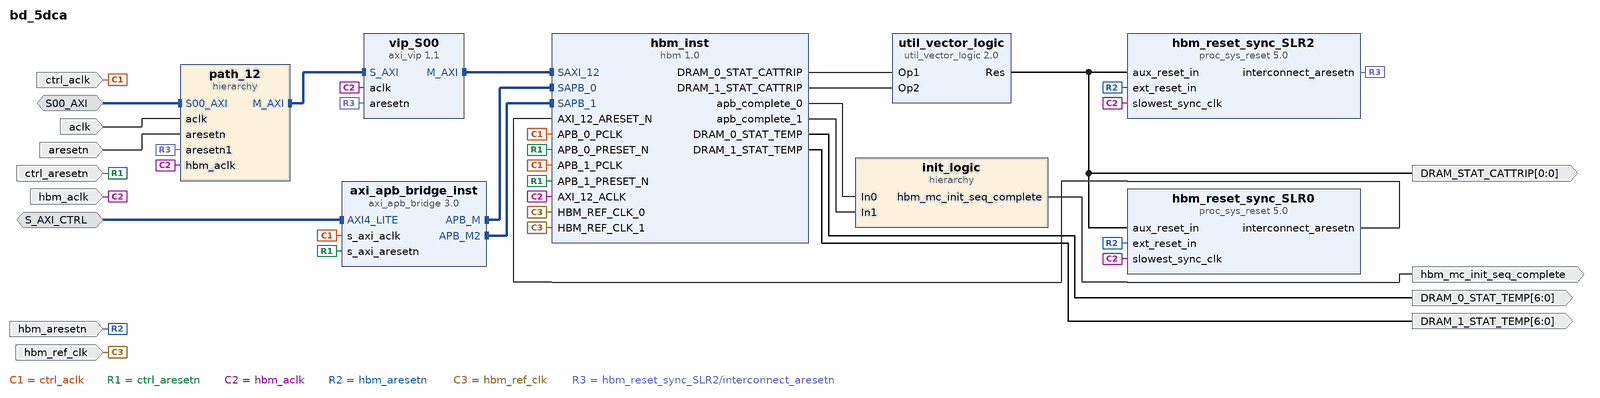
[diagram p0: block diagram of the top level]
# Vivado block design bd_5dca, xcu50-fsvh2104-2-e, Vivado 2022.1
create_bd_design bd_5dca

create_bd_intf_port -mode Slave -vlnv xilinx.com:interface:aximm_rtl:1.0 S_AXI_CTRL
set_property -dict {CONFIG.ADDR_WIDTH 23 CONFIG.PROTOCOL AXI4LITE} [get_bd_intf_ports S_AXI_CTRL]
create_bd_intf_port -mode Slave -vlnv xilinx.com:interface:aximm_rtl:1.0 S00_AXI
set_property -dict [list \
  CONFIG.ADDR_WIDTH 33 \
  CONFIG.DATA_WIDTH 512 \
  CONFIG.NUM_READ_OUTSTANDING 2 \
  CONFIG.NUM_WRITE_OUTSTANDING 2 \
  CONFIG.master_id 1 \
] [get_bd_intf_ports S00_AXI]
create_bd_port -dir I -type clk hbm_aclk
create_bd_port -dir I -type rst hbm_aresetn
set_property -dict {CONFIG.POLARITY ACTIVE_LOW} [get_bd_ports hbm_aresetn]
create_bd_port -dir I -type clk hbm_ref_clk
create_bd_port -dir O hbm_mc_init_seq_complete
create_bd_port -dir O -from 6 -to 0 DRAM_0_STAT_TEMP
create_bd_port -dir O -from 6 -to 0 DRAM_1_STAT_TEMP
create_bd_port -dir O -from 0 -to 0 -type intr DRAM_STAT_CATTRIP
create_bd_port -dir I -type clk ctrl_aclk
set_property -dict {CONFIG.ASSOCIATED_BUSIF S_AXI_CTRL CONFIG.ASSOCIATED_RESET ctrl_aresetn} [get_bd_ports ctrl_aclk]
create_bd_port -dir I -type rst ctrl_aresetn
set_property -dict {CONFIG.POLARITY ACTIVE_LOW} [get_bd_ports ctrl_aresetn]
create_bd_port -dir I -type clk aclk
set_property -dict {CONFIG.ASSOCIATED_BUSIF S00_AXI} [get_bd_ports aclk]
create_bd_port -dir I -type rst aresetn
set_property -dict {CONFIG.POLARITY ACTIVE_LOW} [get_bd_ports aresetn]

create_bd_cell -type ip -vlnv xilinx.com:ip:hbm:1.0 hbm_inst
set_property -dict [list \
  CONFIG.USER_CLK_SEL_LIST0 AXI_12_ACLK \
  CONFIG.USER_DIS_REF_CLK_BUFG TRUE \
  CONFIG.USER_HBM_DENSITY 8GB \
  CONFIG.USER_HBM_STACK 2 \
  CONFIG.USER_INIT_TIMEOUT_VAL 0 \
  CONFIG.USER_MC0_ECC_SCRUB_PERIOD 0x0032 \
  CONFIG.USER_MC0_ENABLE_ECC_CORRECTION true \
  CONFIG.USER_MC0_ENABLE_ECC_SCRUBBING true \
  CONFIG.USER_MC0_TEMP_CTRL_SELF_REF_INTVL true \
  CONFIG.USER_MC10_ECC_SCRUB_PERIOD 0x0032 \
  CONFIG.USER_MC10_ENABLE_ECC_CORRECTION true \
  CONFIG.USER_MC10_ENABLE_ECC_SCRUBBING true \
  CONFIG.USER_MC10_INITILIZE_MEM_USING_ECC_SCRUB true \
  CONFIG.USER_MC10_TEMP_CTRL_SELF_REF_INTVL true \
  CONFIG.USER_MC11_ECC_SCRUB_PERIOD 0x0032 \
  CONFIG.USER_MC11_ENABLE_ECC_CORRECTION true \
  CONFIG.USER_MC11_ENABLE_ECC_SCRUBBING true \
  CONFIG.USER_MC11_INITILIZE_MEM_USING_ECC_SCRUB true \
  CONFIG.USER_MC11_TEMP_CTRL_SELF_REF_INTVL true \
  CONFIG.USER_MC12_ECC_SCRUB_PERIOD 0x0032 \
  CONFIG.USER_MC12_ENABLE_ECC_CORRECTION true \
  CONFIG.USER_MC12_ENABLE_ECC_SCRUBBING true \
  CONFIG.USER_MC12_INITILIZE_MEM_USING_ECC_SCRUB true \
  CONFIG.USER_MC12_TEMP_CTRL_SELF_REF_INTVL true \
  CONFIG.USER_MC13_ECC_SCRUB_PERIOD 0x0032 \
  CONFIG.USER_MC13_ENABLE_ECC_CORRECTION true \
  CONFIG.USER_MC13_ENABLE_ECC_SCRUBBING true \
  CONFIG.USER_MC13_INITILIZE_MEM_USING_ECC_SCRUB true \
  CONFIG.USER_MC13_TEMP_CTRL_SELF_REF_INTVL true \
  CONFIG.USER_MC14_ECC_SCRUB_PERIOD 0x0032 \
  CONFIG.USER_MC14_ENABLE_ECC_CORRECTION true \
  CONFIG.USER_MC14_ENABLE_ECC_SCRUBBING true \
  CONFIG.USER_MC14_INITILIZE_MEM_USING_ECC_SCRUB true \
  CONFIG.USER_MC14_TEMP_CTRL_SELF_REF_INTVL true \
  CONFIG.USER_MC15_ECC_SCRUB_PERIOD 0x0032 \
  CONFIG.USER_MC15_ENABLE_ECC_CORRECTION true \
  CONFIG.USER_MC15_ENABLE_ECC_SCRUBBING true \
  CONFIG.USER_MC15_INITILIZE_MEM_USING_ECC_SCRUB true \
  CONFIG.USER_MC15_TEMP_CTRL_SELF_REF_INTVL true \
  CONFIG.USER_MC1_ECC_SCRUB_PERIOD 0x0032 \
  CONFIG.USER_MC1_ENABLE_ECC_CORRECTION true \
  CONFIG.USER_MC1_ENABLE_ECC_SCRUBBING true \
  CONFIG.USER_MC1_INITILIZE_MEM_USING_ECC_SCRUB true \
  CONFIG.USER_MC1_TEMP_CTRL_SELF_REF_INTVL true \
  CONFIG.USER_MC2_ECC_SCRUB_PERIOD 0x0032 \
  CONFIG.USER_MC2_ENABLE_ECC_CORRECTION true \
  CONFIG.USER_MC2_ENABLE_ECC_SCRUBBING true \
  CONFIG.USER_MC2_INITILIZE_MEM_USING_ECC_SCRUB true \
  CONFIG.USER_MC2_TEMP_CTRL_SELF_REF_INTVL true \
  CONFIG.USER_MC3_ECC_SCRUB_PERIOD 0x0032 \
  CONFIG.USER_MC3_ENABLE_ECC_CORRECTION true \
  CONFIG.USER_MC3_ENABLE_ECC_SCRUBBING true \
  CONFIG.USER_MC3_INITILIZE_MEM_USING_ECC_SCRUB true \
  CONFIG.USER_MC3_TEMP_CTRL_SELF_REF_INTVL true \
  CONFIG.USER_MC4_ECC_SCRUB_PERIOD 0x0032 \
  CONFIG.USER_MC4_ENABLE_ECC_CORRECTION true \
  CONFIG.USER_MC4_ENABLE_ECC_SCRUBBING true \
  CONFIG.USER_MC4_INITILIZE_MEM_USING_ECC_SCRUB true \
  CONFIG.USER_MC4_TEMP_CTRL_SELF_REF_INTVL true \
  CONFIG.USER_MC5_ECC_SCRUB_PERIOD 0x0032 \
  CONFIG.USER_MC5_ENABLE_ECC_CORRECTION true \
  CONFIG.USER_MC5_ENABLE_ECC_SCRUBBING true \
  CONFIG.USER_MC5_INITILIZE_MEM_USING_ECC_SCRUB true \
  CONFIG.USER_MC5_TEMP_CTRL_SELF_REF_INTVL true \
  CONFIG.USER_MC6_ECC_SCRUB_PERIOD 0x0032 \
  CONFIG.USER_MC6_ENABLE_ECC_CORRECTION true \
  CONFIG.USER_MC6_ENABLE_ECC_SCRUBBING true \
  CONFIG.USER_MC6_INITILIZE_MEM_USING_ECC_SCRUB true \
  CONFIG.USER_MC6_TEMP_CTRL_SELF_REF_INTVL true \
  CONFIG.USER_MC7_ECC_SCRUB_PERIOD 0x0032 \
  CONFIG.USER_MC7_ENABLE_ECC_CORRECTION true \
  CONFIG.USER_MC7_ENABLE_ECC_SCRUBBING true \
  CONFIG.USER_MC7_INITILIZE_MEM_USING_ECC_SCRUB true \
  CONFIG.USER_MC7_TEMP_CTRL_SELF_REF_INTVL true \
  CONFIG.USER_MC8_ECC_SCRUB_PERIOD 0x0032 \
  CONFIG.USER_MC8_ENABLE_ECC_CORRECTION true \
  CONFIG.USER_MC8_ENABLE_ECC_SCRUBBING true \
  CONFIG.USER_MC8_INITILIZE_MEM_USING_ECC_SCRUB true \
  CONFIG.USER_MC8_TEMP_CTRL_SELF_REF_INTVL true \
  CONFIG.USER_MC9_ECC_SCRUB_PERIOD 0x0032 \
  CONFIG.USER_MC9_ENABLE_ECC_CORRECTION true \
  CONFIG.USER_MC9_ENABLE_ECC_SCRUBBING true \
  CONFIG.USER_MC9_INITILIZE_MEM_USING_ECC_SCRUB true \
  CONFIG.USER_MC9_TEMP_CTRL_SELF_REF_INTVL true \
  CONFIG.USER_MC_ENABLE_00 TRUE \
  CONFIG.USER_MC_ENABLE_01 TRUE \
  CONFIG.USER_MC_ENABLE_02 TRUE \
  CONFIG.USER_MC_ENABLE_03 TRUE \
  CONFIG.USER_MC_ENABLE_04 TRUE \
  CONFIG.USER_MC_ENABLE_05 TRUE \
  CONFIG.USER_MC_ENABLE_06 TRUE \
  CONFIG.USER_MC_ENABLE_07 TRUE \
  CONFIG.USER_MC_ENABLE_08 TRUE \
  CONFIG.USER_MC_ENABLE_09 TRUE \
  CONFIG.USER_MC_ENABLE_10 TRUE \
  CONFIG.USER_MC_ENABLE_11 TRUE \
  CONFIG.USER_MC_ENABLE_12 TRUE \
  CONFIG.USER_MC_ENABLE_13 TRUE \
  CONFIG.USER_MC_ENABLE_14 TRUE \
  CONFIG.USER_MC_ENABLE_15 TRUE \
  CONFIG.USER_SAXI_00 false \
  CONFIG.USER_SAXI_01 false \
  CONFIG.USER_SAXI_02 false \
  CONFIG.USER_SAXI_03 false \
  CONFIG.USER_SAXI_04 false \
  CONFIG.USER_SAXI_05 false \
  CONFIG.USER_SAXI_06 false \
  CONFIG.USER_SAXI_07 false \
  CONFIG.USER_SAXI_08 false \
  CONFIG.USER_SAXI_09 false \
  CONFIG.USER_SAXI_10 false \
  CONFIG.USER_SAXI_11 false \
  CONFIG.USER_SAXI_12 true \
  CONFIG.USER_SAXI_13 false \
  CONFIG.USER_SAXI_14 false \
  CONFIG.USER_SAXI_15 false \
  CONFIG.USER_SAXI_16 false \
  CONFIG.USER_SAXI_17 false \
  CONFIG.USER_SAXI_18 false \
  CONFIG.USER_SAXI_19 false \
  CONFIG.USER_SAXI_20 false \
  CONFIG.USER_SAXI_21 false \
  CONFIG.USER_SAXI_22 false \
  CONFIG.USER_SAXI_23 false \
  CONFIG.USER_SAXI_24 false \
  CONFIG.USER_SAXI_25 false \
  CONFIG.USER_SAXI_26 false \
  CONFIG.USER_SAXI_27 false \
  CONFIG.USER_SAXI_28 false \
  CONFIG.USER_SAXI_29 false \
  CONFIG.USER_SAXI_30 false \
  CONFIG.USER_SAXI_31 false \
  CONFIG.USER_SWITCH_ENABLE_01 TRUE \
  CONFIG.USER_XSDB_INTF_EN FALSE \
] [get_bd_cells hbm_inst]
create_bd_cell -type ip -vlnv xilinx.com:ip:proc_sys_reset:5.0 hbm_reset_sync_SLR0
set_property -dict {CONFIG.C_AUX_RESET_HIGH 1} [get_bd_cells hbm_reset_sync_SLR0]
create_bd_cell -type ip -vlnv xilinx.com:ip:proc_sys_reset:5.0 hbm_reset_sync_SLR2
set_property -dict {CONFIG.C_AUX_RESET_HIGH 1} [get_bd_cells hbm_reset_sync_SLR2]
create_bd_cell -type ip -vlnv xilinx.com:ip:axi_vip:1.1 vip_S00
create_bd_cell -type ip -vlnv xilinx.com:ip:axi_apb_bridge:3.0 axi_apb_bridge_inst
set_property -dict {CONFIG.C_APB_NUM_SLAVES 2 CONFIG.C_M_APB_PROTOCOL apb3} [get_bd_cells axi_apb_bridge_inst]
create_bd_cell -type ip -vlnv xilinx.com:ip:util_vector_logic:2.0 util_vector_logic
set_property -dict {CONFIG.C_OPERATION or CONFIG.C_SIZE 1} [get_bd_cells util_vector_logic]
create_bd_cell -type hier path_12
create_bd_cell -type hier init_logic

# ---- hierarchy /path_12 ----
current_bd_instance /path_12
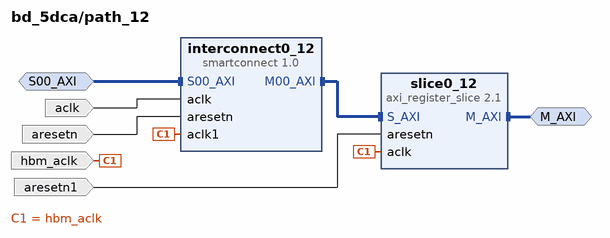
[diagram p1: block diagram inside /path_12]
create_bd_intf_pin -mode Slave -vlnv xilinx.com:interface:aximm_rtl:1.0 S00_AXI
create_bd_intf_pin -mode Master -vlnv xilinx.com:interface:aximm_rtl:1.0 M_AXI
create_bd_pin -dir I -type clk aclk
create_bd_pin -dir I -type rst aresetn
create_bd_pin -dir I -type clk hbm_aclk
create_bd_pin -dir I -type rst aresetn1

create_bd_cell -type ip -vlnv xilinx.com:ip:smartconnect:1.0 interconnect0_12
set_property -dict [list \
  CONFIG.ADVANCED_PROPERTIES {__view__ {functional {S00_Entry {SUPPORTS_WRAP 0}} timing {S00_Entry {MMU_REGSLICE 1} M00_Exit {REGSLICE 1}}}} \
  CONFIG.NUM_CLKS 2 \
  CONFIG.NUM_SI 1 \
] [get_bd_cells interconnect0_12]
create_bd_cell -type ip -vlnv xilinx.com:ip:axi_register_slice:2.1 slice0_12
set_property -dict [list \
  CONFIG.NUM_SLR_CROSSINGS 2 \
  CONFIG.PIPELINES_MASTER_AR 4 \
  CONFIG.PIPELINES_MASTER_AW 4 \
  CONFIG.PIPELINES_MASTER_B 4 \
  CONFIG.PIPELINES_MASTER_R 4 \
  CONFIG.PIPELINES_MASTER_W 4 \
  CONFIG.PIPELINES_MIDDLE_AR 4 \
  CONFIG.PIPELINES_MIDDLE_AW 4 \
  CONFIG.PIPELINES_MIDDLE_B 4 \
  CONFIG.PIPELINES_MIDDLE_R 4 \
  CONFIG.PIPELINES_MIDDLE_W 4 \
  CONFIG.PIPELINES_SLAVE_AR 4 \
  CONFIG.PIPELINES_SLAVE_AW 4 \
  CONFIG.PIPELINES_SLAVE_B 4 \
  CONFIG.PIPELINES_SLAVE_R 4 \
  CONFIG.PIPELINES_SLAVE_W 4 \
  CONFIG.REG_AR 15 \
  CONFIG.REG_AW 15 \
  CONFIG.REG_B 15 \
  CONFIG.REG_R 15 \
  CONFIG.REG_W 15 \
] [get_bd_cells slice0_12]

# ---- hierarchy /init_logic ----
current_bd_instance /init_logic
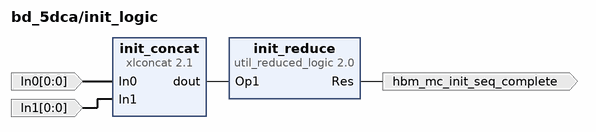
[diagram p2: block diagram inside /init_logic]
create_bd_pin -dir I -from 0 -to 0 In0
create_bd_pin -dir I -from 0 -to 0 In1
create_bd_pin -dir O hbm_mc_init_seq_complete

create_bd_cell -type ip -vlnv xilinx.com:ip:xlconcat:2.1 init_concat
set_property -dict {CONFIG.NUM_PORTS 2} [get_bd_cells init_concat]
create_bd_cell -type ip -vlnv xilinx.com:ip:util_reduced_logic:2.0 init_reduce
set_property -dict {CONFIG.C_OPERATION and CONFIG.C_SIZE 2} [get_bd_cells init_reduce]

# ---- connections ----

current_bd_instance /path_12
connect_bd_intf_net [get_bd_intf_pins S00_AXI] [get_bd_intf_pins interconnect0_12/S00_AXI]
connect_bd_intf_net [get_bd_intf_pins interconnect0_12/M00_AXI] [get_bd_intf_pins slice0_12/S_AXI]
connect_bd_intf_net [get_bd_intf_pins M_AXI] [get_bd_intf_pins slice0_12/M_AXI]
connect_bd_net [get_bd_pins aclk] [get_bd_pins interconnect0_12/aclk]
connect_bd_net [get_bd_pins aresetn] [get_bd_pins interconnect0_12/aresetn]
connect_bd_net [get_bd_pins hbm_aclk] [get_bd_pins slice0_12/aclk] [get_bd_pins interconnect0_12/aclk1]
connect_bd_net -net hbm_reset_sync_SLR2_interconnect_aresetn [get_bd_pins aresetn1] [get_bd_pins slice0_12/aresetn]

current_bd_instance /init_logic
connect_bd_net -net hbm_inst_apb_complete_0 [get_bd_pins In0] [get_bd_pins init_concat/In0]
connect_bd_net -net hbm_inst_apb_complete_1 [get_bd_pins In1] [get_bd_pins init_concat/In1]
connect_bd_net [get_bd_pins init_concat/dout] [get_bd_pins init_reduce/Op1]
connect_bd_net [get_bd_pins init_reduce/Res] [get_bd_pins hbm_mc_init_seq_complete]

current_bd_instance /
connect_bd_intf_net [get_bd_intf_ports S00_AXI] [get_bd_intf_pins path_12/S00_AXI]
connect_bd_intf_net [get_bd_intf_ports S_AXI_CTRL] [get_bd_intf_pins axi_apb_bridge_inst/AXI4_LITE]
connect_bd_intf_net [get_bd_intf_pins axi_apb_bridge_inst/APB_M] [get_bd_intf_pins hbm_inst/SAPB_0]
connect_bd_intf_net [get_bd_intf_pins axi_apb_bridge_inst/APB_M2] [get_bd_intf_pins hbm_inst/SAPB_1]
connect_bd_intf_net -intf_net slice0_12_M_AXI [get_bd_intf_pins path_12/M_AXI] [get_bd_intf_pins vip_S00/S_AXI]
connect_bd_intf_net [get_bd_intf_pins vip_S00/M_AXI] [get_bd_intf_pins hbm_inst/SAXI_12]
connect_bd_net [get_bd_ports aclk] [get_bd_pins path_12/aclk]
connect_bd_net [get_bd_ports aresetn] [get_bd_pins path_12/aresetn]
connect_bd_net -net cattrip_net [get_bd_pins util_vector_logic/Res] \
  [get_bd_pins hbm_reset_sync_SLR0/aux_reset_in] [get_bd_pins hbm_reset_sync_SLR2/aux_reset_in] \
  [get_bd_ports DRAM_STAT_CATTRIP]
connect_bd_net [get_bd_ports ctrl_aclk] \
  [get_bd_pins axi_apb_bridge_inst/s_axi_aclk] [get_bd_pins hbm_inst/APB_0_PCLK] [get_bd_pins hbm_inst/APB_1_PCLK]
connect_bd_net [get_bd_ports ctrl_aresetn] \
  [get_bd_pins axi_apb_bridge_inst/s_axi_aresetn] [get_bd_pins hbm_inst/APB_0_PRESET_N] [get_bd_pins hbm_inst/APB_1_PRESET_N]
connect_bd_net [get_bd_ports hbm_aclk] \
  [get_bd_pins hbm_reset_sync_SLR0/slowest_sync_clk] [get_bd_pins hbm_reset_sync_SLR2/slowest_sync_clk] \
  [get_bd_pins vip_S00/aclk] [get_bd_pins hbm_inst/AXI_12_ACLK] [get_bd_pins path_12/hbm_aclk]
connect_bd_net [get_bd_ports hbm_aresetn] [get_bd_pins hbm_reset_sync_SLR0/ext_reset_in] [get_bd_pins hbm_reset_sync_SLR2/ext_reset_in]
connect_bd_net [get_bd_pins hbm_inst/DRAM_0_STAT_CATTRIP] [get_bd_pins util_vector_logic/Op1]
connect_bd_net [get_bd_pins hbm_inst/DRAM_0_STAT_TEMP] [get_bd_ports DRAM_0_STAT_TEMP]
connect_bd_net [get_bd_pins hbm_inst/DRAM_1_STAT_CATTRIP] [get_bd_pins util_vector_logic/Op2]
connect_bd_net [get_bd_pins hbm_inst/DRAM_1_STAT_TEMP] [get_bd_ports DRAM_1_STAT_TEMP]
connect_bd_net [get_bd_pins hbm_inst/apb_complete_0] [get_bd_pins init_logic/In0]
connect_bd_net [get_bd_pins hbm_inst/apb_complete_1] [get_bd_pins init_logic/In1]
connect_bd_net [get_bd_ports hbm_ref_clk] [get_bd_pins hbm_inst/HBM_REF_CLK_0] [get_bd_pins hbm_inst/HBM_REF_CLK_1]
connect_bd_net [get_bd_pins hbm_reset_sync_SLR0/interconnect_aresetn] [get_bd_pins hbm_inst/AXI_12_ARESET_N]
connect_bd_net [get_bd_pins hbm_reset_sync_SLR2/interconnect_aresetn] [get_bd_pins vip_S00/aresetn] [get_bd_pins path_12/aresetn1]
connect_bd_net -net init_reduce_Res [get_bd_pins init_logic/hbm_mc_init_seq_complete] [get_bd_ports hbm_mc_init_seq_complete]

# ---- address map ----
assign_bd_address -offset 0x000000000 -range 256M -target_address_space [get_bd_addr_spaces S00_AXI] [get_bd_addr_segs hbm_inst/SAXI_12/HBM_MEM00]
assign_bd_address -offset 0x010000000 -range 256M -target_address_space [get_bd_addr_spaces S00_AXI] [get_bd_addr_segs hbm_inst/SAXI_12/HBM_MEM01]
assign_bd_address -offset 0x020000000 -range 256M -target_address_space [get_bd_addr_spaces S00_AXI] [get_bd_addr_segs hbm_inst/SAXI_12/HBM_MEM02]
assign_bd_address -offset 0x030000000 -range 256M -target_address_space [get_bd_addr_spaces S00_AXI] [get_bd_addr_segs hbm_inst/SAXI_12/HBM_MEM03]
assign_bd_address -offset 0x040000000 -range 256M -target_address_space [get_bd_addr_spaces S00_AXI] [get_bd_addr_segs hbm_inst/SAXI_12/HBM_MEM04]
assign_bd_address -offset 0x050000000 -range 256M -target_address_space [get_bd_addr_spaces S00_AXI] [get_bd_addr_segs hbm_inst/SAXI_12/HBM_MEM05]
assign_bd_address -offset 0x060000000 -range 256M -target_address_space [get_bd_addr_spaces S00_AXI] [get_bd_addr_segs hbm_inst/SAXI_12/HBM_MEM06]
assign_bd_address -offset 0x070000000 -range 256M -target_address_space [get_bd_addr_spaces S00_AXI] [get_bd_addr_segs hbm_inst/SAXI_12/HBM_MEM07]
assign_bd_address -offset 0x080000000 -range 256M -target_address_space [get_bd_addr_spaces S00_AXI] [get_bd_addr_segs hbm_inst/SAXI_12/HBM_MEM08]
assign_bd_address -offset 0x090000000 -range 256M -target_address_space [get_bd_addr_spaces S00_AXI] [get_bd_addr_segs hbm_inst/SAXI_12/HBM_MEM09]
assign_bd_address -offset 0x0A0000000 -range 256M -target_address_space [get_bd_addr_spaces S00_AXI] [get_bd_addr_segs hbm_inst/SAXI_12/HBM_MEM10]
assign_bd_address -offset 0x0B0000000 -range 256M -target_address_space [get_bd_addr_spaces S00_AXI] [get_bd_addr_segs hbm_inst/SAXI_12/HBM_MEM11]
assign_bd_address -offset 0x0C0000000 -range 256M -target_address_space [get_bd_addr_spaces S00_AXI] [get_bd_addr_segs hbm_inst/SAXI_12/HBM_MEM12]
assign_bd_address -offset 0x0D0000000 -range 256M -target_address_space [get_bd_addr_spaces S00_AXI] [get_bd_addr_segs hbm_inst/SAXI_12/HBM_MEM13]
assign_bd_address -offset 0x0E0000000 -range 256M -target_address_space [get_bd_addr_spaces S00_AXI] [get_bd_addr_segs hbm_inst/SAXI_12/HBM_MEM14]
assign_bd_address -offset 0x0F0000000 -range 256M -target_address_space [get_bd_addr_spaces S00_AXI] [get_bd_addr_segs hbm_inst/SAXI_12/HBM_MEM15]
assign_bd_address -offset 0x100000000 -range 256M -target_address_space [get_bd_addr_spaces S00_AXI] [get_bd_addr_segs hbm_inst/SAXI_12/HBM_MEM16]
assign_bd_address -offset 0x110000000 -range 256M -target_address_space [get_bd_addr_spaces S00_AXI] [get_bd_addr_segs hbm_inst/SAXI_12/HBM_MEM17]
assign_bd_address -offset 0x120000000 -range 256M -target_address_space [get_bd_addr_spaces S00_AXI] [get_bd_addr_segs hbm_inst/SAXI_12/HBM_MEM18]
assign_bd_address -offset 0x130000000 -range 256M -target_address_space [get_bd_addr_spaces S00_AXI] [get_bd_addr_segs hbm_inst/SAXI_12/HBM_MEM19]
assign_bd_address -offset 0x140000000 -range 256M -target_address_space [get_bd_addr_spaces S00_AXI] [get_bd_addr_segs hbm_inst/SAXI_12/HBM_MEM20]
assign_bd_address -offset 0x150000000 -range 256M -target_address_space [get_bd_addr_spaces S00_AXI] [get_bd_addr_segs hbm_inst/SAXI_12/HBM_MEM21]
assign_bd_address -offset 0x160000000 -range 256M -target_address_space [get_bd_addr_spaces S00_AXI] [get_bd_addr_segs hbm_inst/SAXI_12/HBM_MEM22]
assign_bd_address -offset 0x170000000 -range 256M -target_address_space [get_bd_addr_spaces S00_AXI] [get_bd_addr_segs hbm_inst/SAXI_12/HBM_MEM23]
assign_bd_address -offset 0x180000000 -range 256M -target_address_space [get_bd_addr_spaces S00_AXI] [get_bd_addr_segs hbm_inst/SAXI_12/HBM_MEM24]
assign_bd_address -offset 0x190000000 -range 256M -target_address_space [get_bd_addr_spaces S00_AXI] [get_bd_addr_segs hbm_inst/SAXI_12/HBM_MEM25]
assign_bd_address -offset 0x1A0000000 -range 256M -target_address_space [get_bd_addr_spaces S00_AXI] [get_bd_addr_segs hbm_inst/SAXI_12/HBM_MEM26]
assign_bd_address -offset 0x1B0000000 -range 256M -target_address_space [get_bd_addr_spaces S00_AXI] [get_bd_addr_segs hbm_inst/SAXI_12/HBM_MEM27]
assign_bd_address -offset 0x1C0000000 -range 256M -target_address_space [get_bd_addr_spaces S00_AXI] [get_bd_addr_segs hbm_inst/SAXI_12/HBM_MEM28]
assign_bd_address -offset 0x1D0000000 -range 256M -target_address_space [get_bd_addr_spaces S00_AXI] [get_bd_addr_segs hbm_inst/SAXI_12/HBM_MEM29]
assign_bd_address -offset 0x1E0000000 -range 256M -target_address_space [get_bd_addr_spaces S00_AXI] [get_bd_addr_segs hbm_inst/SAXI_12/HBM_MEM30]
assign_bd_address -offset 0x1F0000000 -range 256M -target_address_space [get_bd_addr_spaces S00_AXI] [get_bd_addr_segs hbm_inst/SAXI_12/HBM_MEM31]
assign_bd_address -offset 0x000000 -range 4M -target_address_space [get_bd_addr_spaces S_AXI_CTRL] [get_bd_addr_segs hbm_inst/SAPB_0/Reg]
assign_bd_address -offset 0x400000 -range 4M -target_address_space [get_bd_addr_spaces S_AXI_CTRL] [get_bd_addr_segs hbm_inst/SAPB_1/Reg]

validate_bd_design
save_bd_design
